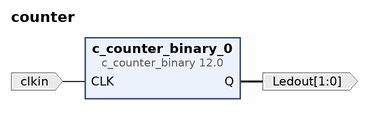
[diagram p0: block diagram of the top level]
# Vivado block design counter, xc7a35tcpg236-1, Vivado 2016.3
create_bd_design counter

create_bd_port -dir I -type clk clkin
set_property -dict {CONFIG.FREQ_HZ 10000000} [get_bd_ports clkin]
create_bd_port -dir O -from 1 -to 0 -type data Ledout

create_bd_cell -type ip -vlnv xilinx.com:ip:c_counter_binary:12.0 c_counter_binary_0
set_property -dict {CONFIG.Output_Width 2} [get_bd_cells c_counter_binary_0]

# ---- connections ----

connect_bd_net -net CLK_1 [get_bd_ports clkin] [get_bd_pins c_counter_binary_0/CLK]
connect_bd_net [get_bd_pins c_counter_binary_0/Q] [get_bd_ports Ledout]

validate_bd_design
save_bd_design
